# EAGLE design evpr_mini (EAGLE 9.5.2)
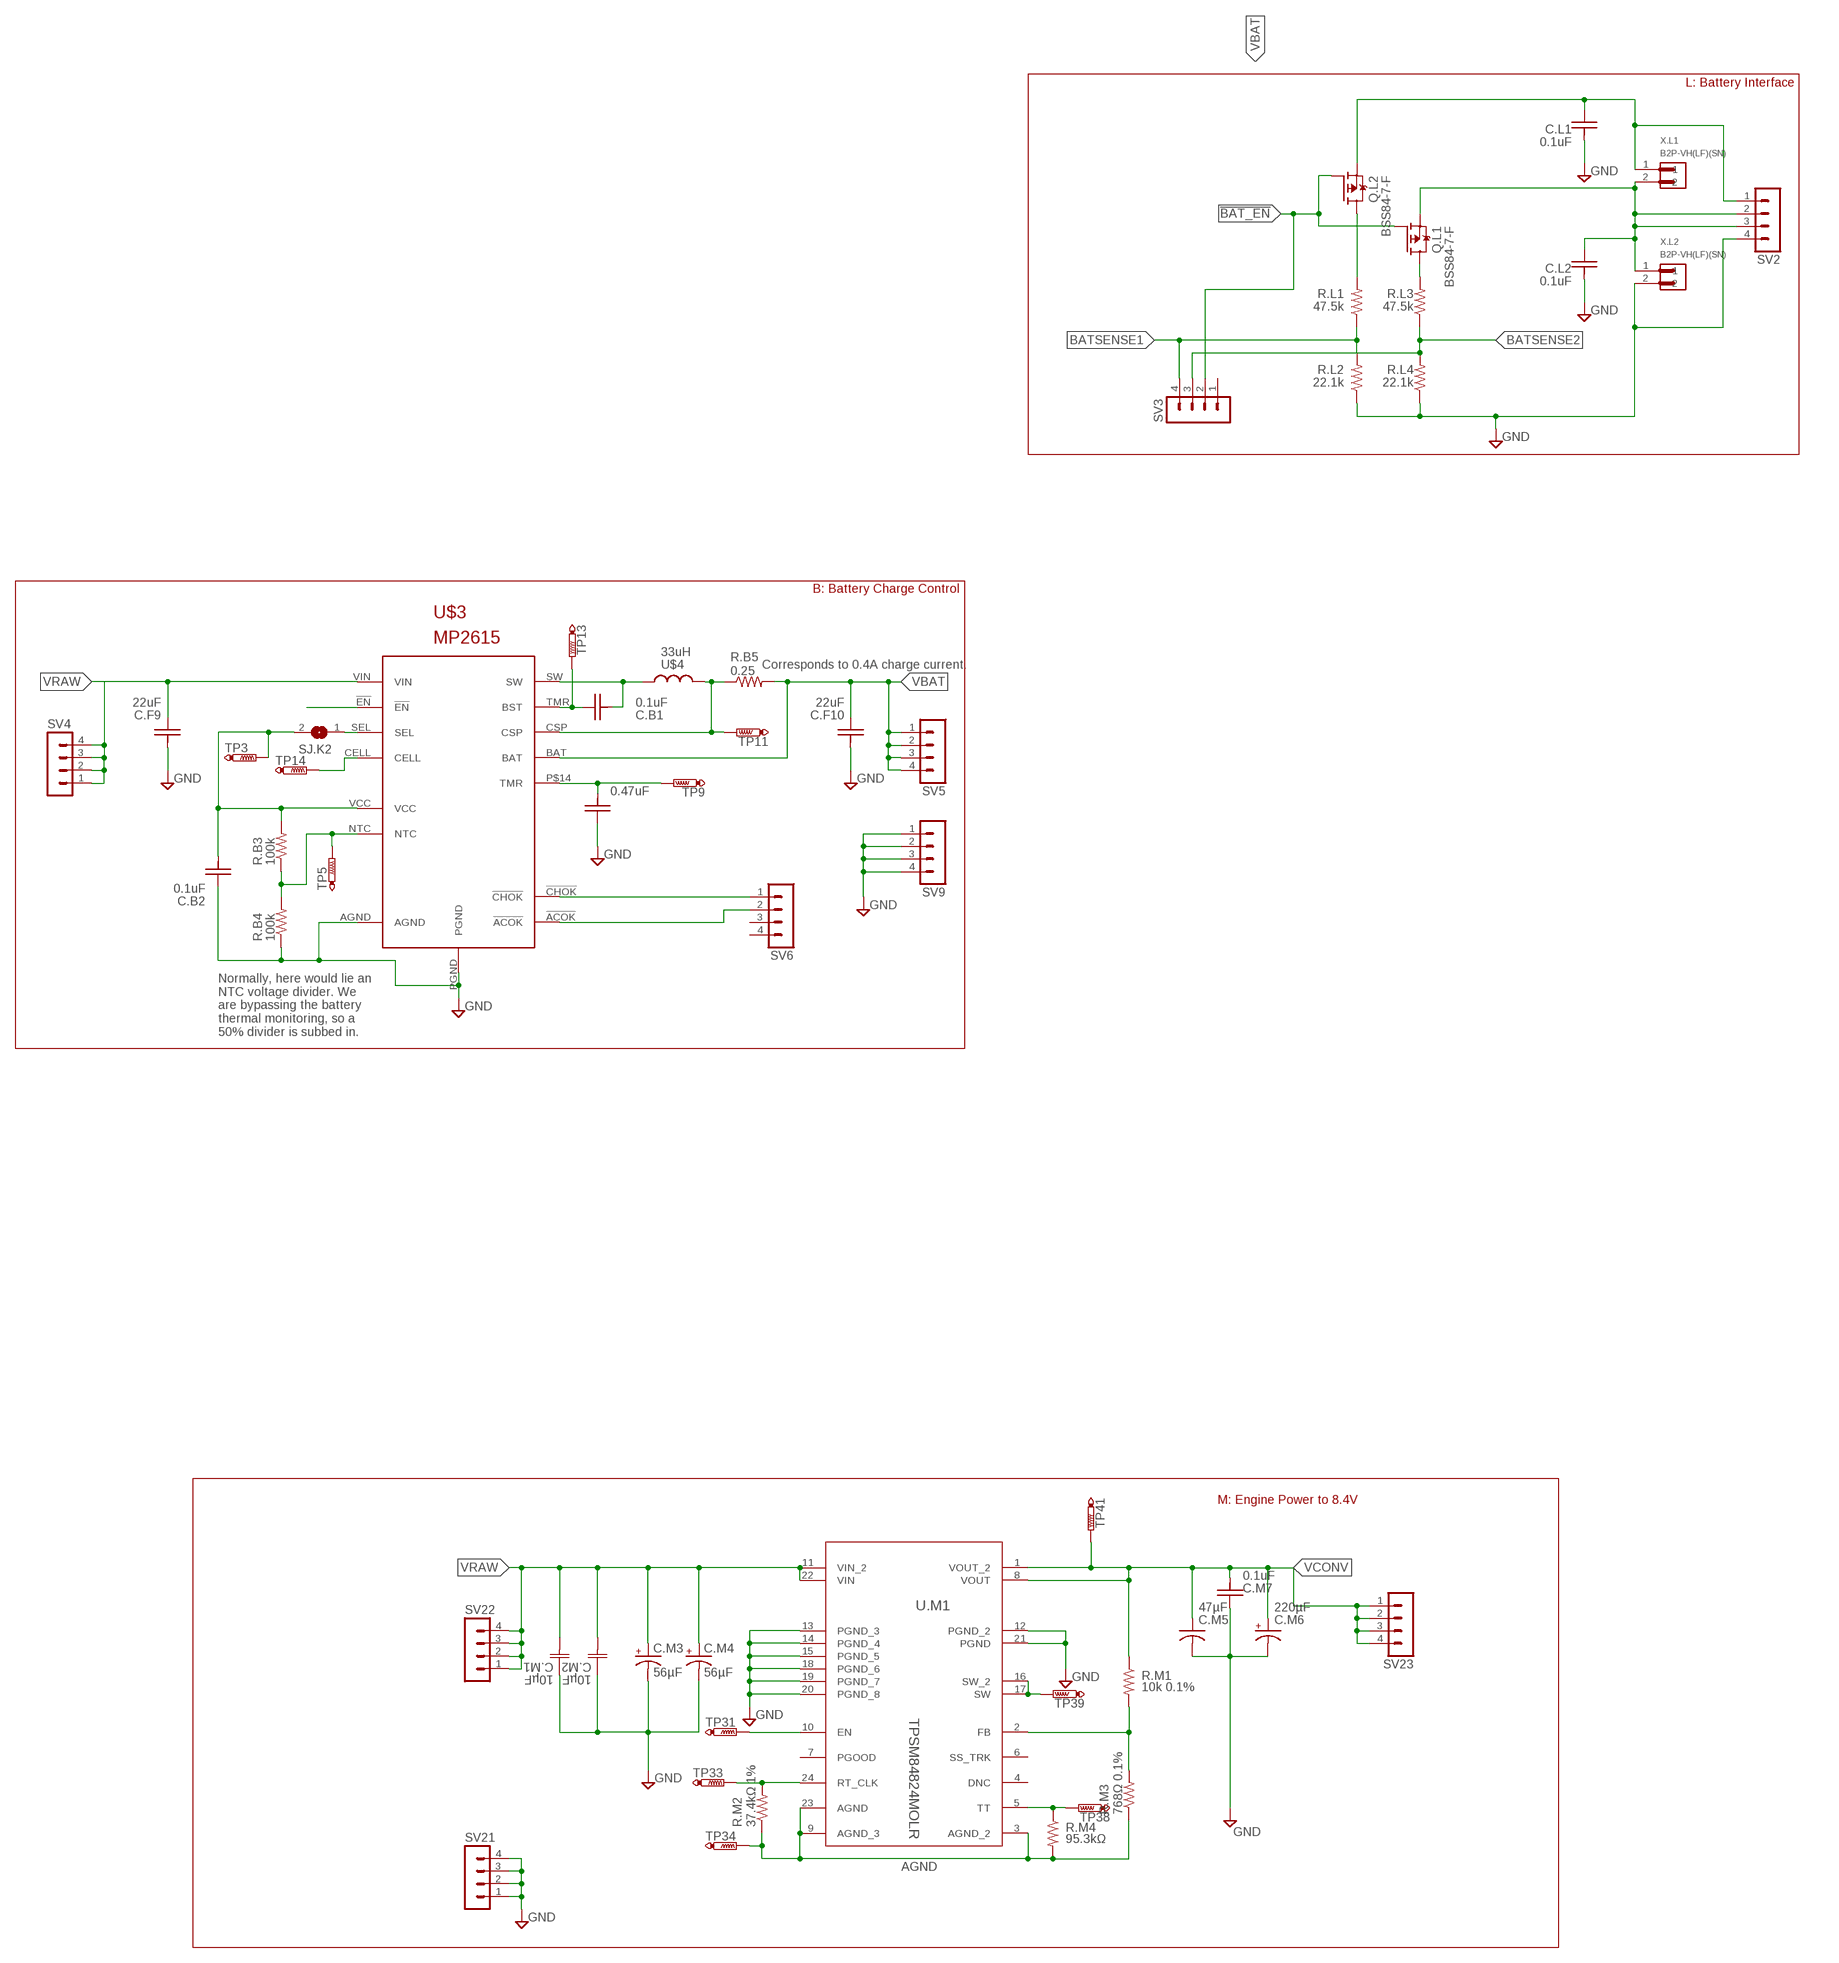
[diagram p0: schematic, sheet 1, part 1 of 2]
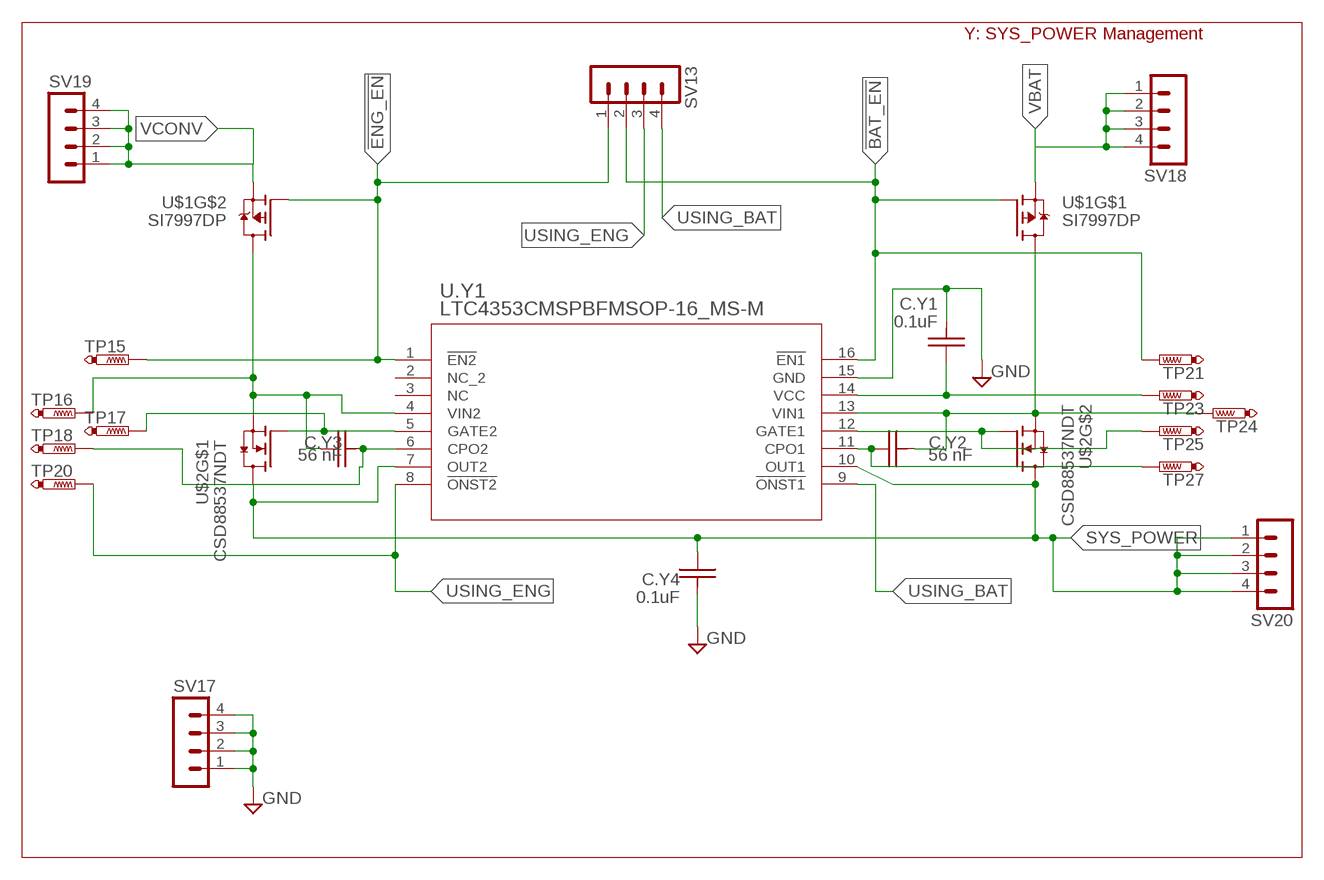
[diagram p1: schematic, sheet 1, part 2 of 2]

## Parts
C.B1  0.1uF  C0603  [C0603]
C.B2  0.1uF  C0603  [C0603]
C.F9  22uF  C0603  [C0603]
C.F10  22uF  C0603  [C0603]
C.J3  0.47uF  C0603  [C0603]
C.L1  0.1uF  C0603  [C0603]
C.L2  0.1uF  C0603  [C0603]
C.M1  10µF  C3225X7R1E106K250AC  [CAP_3225]
C.M2  10µF  C3225X7R1E106K250AC  [CAP_3225]
C.M3  56µF  6.3MMCAP  [OSCON_SVPF_6.3MM]
C.M4  56µF  6.3MMCAP  [OSCON_SVPF_6.3MM]
C.M5  47µF  C-USC1210  [C1210]
C.M6  220µF  WURTH875115352003  [C6CYLCAP]
C.M7  0.1uF  C0603  [C0603]
C.Y1  0.1uF  C0603  [C0603]
C.Y2  56 nF  C0603  [C0603]
C.Y3  56 nF  C0603  [C0603]
C.Y4  0.1uF  C0603  [C0603]
Q.L1  BSS84-7-F  [SOT23]
Q.L2  BSS84-7-F  [SOT23]
R.B3  100k  R0603  [R0603]
R.B4  100k  R0603  [R0603]
R.B5  0.25  R0603  [R0603]
R.L1  47.5k  R0603  [R0603]
R.L2  22.1k  R0603  [R0603]
R.L3  47.5k  R0603  [R0603]
R.L4  22.1k  R0603  [R0603]
R.M1  10k 0.1%  R0603  [R0603]
R.M2  37.4kΩ 1%  R0603  [R0603]
R.M3  768Ω 0.1%  R0603  [R0603]
R.M4  95.3kΩ  R0603  [R0603]
SJ.K2  SJ  [SJ]
SV2  MA04-1  [MA04-1]
SV3  MA04-1  [MA04-1]
SV4  MA04-1  [MA04-1]
SV5  MA04-1  [MA04-1]
SV6  MA04-1  [MA04-1]
SV9  MA04-1  [MA04-1]
SV13  MA04-1  [MA04-1]
SV17  MA04-1  [MA04-1]
SV18  MA04-1  [MA04-1]
SV19  MA04-1  [MA04-1]
SV20  MA04-1  [MA04-1]
SV21  MA04-1  [MA04-1]
SV22  MA04-1  [MA04-1]
SV23  MA04-1  [MA04-1]
TP3  PTR1TP10R  [TP10R]
TP5  PTR1TP10R  [TP10R]
TP9  PTR1TP10R  [TP10R]
TP11  PTR1TP10R  [TP10R]
TP13  PTR1TP10R  [TP10R]
TP14  PTR1TP10R  [TP10R]
TP15  PTR1TP10R  [TP10R]
TP16  PTR1TP10R  [TP10R]
TP17  PTR1TP10R  [TP10R]
TP18  PTR1TP10R  [TP10R]
TP20  PTR1TP10R  [TP10R]
TP21  PTR1TP10R  [TP10R]
TP23  PTR1TP10R  [TP10R]
TP24  PTR1TP10R  [TP10R]
TP25  PTR1TP10R  [TP10R]
TP27  PTR1TP10R  [TP10R]
TP31  PTR1TP10R  [TP10R]
TP33  PTR1TP10R  [TP10R]
TP34  PTR1TP10R  [TP10R]
TP38  PTR1TP10R  [TP10R]
TP39  PTR1TP10R  [TP10R]
TP41  PTR1TP10R  [TP10R]
U$1  SI7997DP  [POWERPAK_SO8DUAL]
U$2  CSD88537NDT  [SOIC8]
U$3  MP2615  [QFN16]
U$4  33uH  SRN5040TA-330M  [SRN5040TA]
U.M1  TPSM84824MOLR  [MOL0024A]
U.Y1  LTC4353CMSPBFMSOP-16_MS-M  [MSOP-16_MS-M]
X.L1  B2P-VH(LF)(SN)  [JST_B2P-VH(LF)(SN)]
X.L2  B2P-VH(LF)(SN)  [JST_B2P-VH(LF)(SN)]

## Nets
!ACOK: SV6.2 U$3.!ACOK
!BAT_EN: Q.L1.1(G) Q.L2.1(G) SV3.2 SV13.2 TP21.TP U$1.P$2(G) U.Y1.16(!EN1)
!CHGOK: SV6.1 U$3.!CHOK
!ENG_EN: SV13.1 TP15.TP U$1.P$4(G) U.Y1.1(!EN2)
AGND: R.M2.1 R.M3.1 R.M4.2 TP34.TP U.M1.3(AGND_2) U.M1.9(AGND_3) U.M1.23(AGND)
BATSENSE1: R.L1.1 R.L2.2 SV3.4
BATSENSE2: R.L3.1 R.L4.2 SV3.3
GND: C.B2.1 C.F9.2 C.F10.2 C.J3.1 C.L1.2 C.L2.2 C.M1.1 C.M2.1 C.M3.- C.M4.- C.M5.2 C.M6.P$1(-) C.M7.1 C.Y1.2 C.Y4.2 R.B4.1 R.L2.1 R.L4.1 SV2.4 SV9.1 SV9.2 SV9.3 SV9.4 SV17.1 SV17.2 SV17.3 SV17.4 SV21.1 SV21.2 SV21.3 SV21.4 U$3.AGND U$3.PGND U.M1.12(PGND_2) U.M1.13(PGND_3) U.M1.14(PGND_4) U.M1.15(PGND_5) U.M1.18(PGND_6) U.M1.19(PGND_7) U.M1.20(PGND_8) U.M1.21(PGND) U.Y1.15(GND) X.L2.2
N$1: U$3.!EN
N$2: TP14.TP U$3.CELL
N$3: R.M1.2 R.M3.2 U.M1.2(FB)
N$4: TP25.TP U$2.4(G) U.Y1.12(GATE1)
N$5: C.Y3.1 TP16.TP U$1.D$2A(D) U$2.1(S) U.Y1.4(VIN2)
N$6: C.Y2.2 TP24.TP U$1.D$1B(D) U$2.3(S) U.Y1.13(VIN1)
N$7: C.J3.2 TP9.TP U$3.P$14(TMR)
N$8: C.L2.1 Q.L1.2(S) SV2.2 SV2.3 X.L1.2 X.L2.1
N$10: TP17.TP U$2.2(G) U.Y1.5(GATE2)
N$11: TP31.TP U.M1.10(EN)
N$13: Q.L2.3(D) R.L1.2
N$15: TP39.TP U.M1.16(SW_2) U.M1.17(SW)
N$17: R.M2.2 TP33.TP U.M1.24(RT_CLK)
N$31: R.M4.1 TP38.TP U.M1.5(TT)
N$32: C.Y1.1 TP23.TP U.Y1.14(VCC)
N$33: Q.L1.3(D) R.L3.2
N$37: C.Y2.1 TP27.TP U.Y1.11(CPO1)
N$38: C.Y3.2 TP18.TP U.Y1.6(CPO2)
N$48: R.B3.1 R.B4.2 TP5.TP U$3.NTC
N$52: C.B2.2 R.B3.2 SJ.K2.2 TP3.TP U$3.VCC
N$56: R.B5.1 TP11.TP U$3.CSP U$4.P$2
N$58: SJ.K2.1 U$3.SEL
N$59: C.B1.1 TP13.TP U$3.TMR(BST)
N$60: C.B1.2 U$3.SW U$4.P$1
SYS_POWER: C.Y4.1 SV20.1 SV20.2 SV20.3 SV20.4 U$2.5(D) U$2.6(D) U$2.7(D) U$2.8(D) U.Y1.7(OUT2) U.Y1.10(OUT1)
USING_BAT: SV13.4 U.Y1.9(!ONST1)
USING_ENG: SV13.3 TP20.TP U.Y1.8(!ONST2)
VBAT: C.F10.1 C.L1.1 Q.L2.2(S) R.B5.2 SV2.1 SV5.1 SV5.2 SV5.3 SV5.4 SV18.1 SV18.2 SV18.3 SV18.4 U$1.P$1(S) U$3.BAT X.L1.1
VCONV: C.M5.1 C.M6.P$2(+) C.M7.2 R.M1.1 SV19.1 SV19.2 SV19.3 SV19.4 SV23.1 SV23.2 SV23.3 SV23.4 TP41.TP U$1.P$3(S) U.M1.1(VOUT_2) U.M1.8(VOUT)
VRAW: C.F9.1 C.M1.2 C.M2.2 C.M3.+ C.M4.+ SV4.1 SV4.2 SV4.3 SV4.4 SV22.1 SV22.2 SV22.3 SV22.4 U$3.VIN U.M1.11(VIN_2) U.M1.22(VIN)
Unconnected: SV3.1 SV6.3 SV6.4 U.M1.4(DNC) U.M1.6(SS_TRK) U.M1.7(PGOOD) U.Y1.2(NC_2) U.Y1.3(NC)

## Notes on the sheet
- L: Battery Interface
- B: Battery Charge Control
- Corresponds to 0.4A charge current.
- Normally, here would lie an
  NTC voltage divider. We
  are bypassing the battery
  thermal monitoring, so a 
  50% divider is subbed in.
- Y: SYS_POWER Management
- M: Engine Power to 8.4V

## Library data of the parts
C.B1 C.B2 C.L1 C.L2 C.M7 C.Y1 C.Y4 = mccloud:C0603: CAPACITOR, American symbol; COMPONENT: 06033C104JAT2A
C.F9 C.F10 = mccloud:C0603: CAPACITOR, American symbol; COMPONENT: CL10A226MO7JZNC
C.J3 = mccloud:C0603: CAPACITOR, American symbol; COMPONENT: C0603C474K4PACTU
C.M1 C.M2 = mccloud:C3225X7R1E106K250AC; COMPONENT: C3225X7R1E106K250AC
C.M3 C.M4 = mccloud:6.3MMCAP; COMPONENT: APXG250ARA560MF61G
C.M5 = rcl:C-US: CAPACITOR, American symbol; COMPONENT: CL32A476KOJNNNE; SPICEPREFIX: C
C.M6 = mccloud:WURTH875115352003; COMPONENT: 875075355002
C.Y2 C.Y3 = mccloud:C0603: CAPACITOR, American symbol; COMPONENT: CL10B562KB8NNNC
Q.L1 Q.L2 = mccloud:BSS84-7-F; COMPONENT: BSS84-7-F
R.B3 R.B4 = mccloud:R0603: RESISTOR, American symbol; COMPONENT: RMCF0603FT100K; SPICEPREFIX: R
R.B5 = mccloud:R0603: RESISTOR, American symbol; COMPONENT: CSR0603FKR250; SPICEPREFIX: R
R.L1 R.L3 = mccloud:R0603: RESISTOR, American symbol; COMPONENT: RMCF0603FT47K5; SPICEPREFIX: R
R.L2 R.L4 = mccloud:R0603: RESISTOR, American symbol; COMPONENT: RMCF0603FT22K1; SPICEPREFIX: R
R.M1 = mccloud:R0603: RESISTOR, American symbol; COMPONENT: RG1608P-103-B-T5; SPICEPREFIX: R
R.M2 = mccloud:R0603: RESISTOR, American symbol; COMPONENT: RC0603FR-0737K4L; SPICEPREFIX: R
R.M3 = mccloud:R0603: RESISTOR, American symbol; COMPONENT: RQ73C1J768RBTD; SPICEPREFIX: R
R.M4 = mccloud:R0603: RESISTOR, American symbol; COMPONENT: RMCF0603FT95K3; SPICEPREFIX: R
SJ.K2 = jumper:SJ: SMD solder JUMPER
SV2-SV6 SV9 SV13 SV17-SV23 = con-lstb:MA04-1: PIN HEADER; OC_FARNELL: unknown; OC_NEWARK: unknown
TP3 TP5 TP9 TP11 TP13-TP18 TP20 TP21 TP23-TP25 TP27 TP31 TP33 TP34 TP38 TP39 TP41 = testpad:PTR1: TEST PIN
U$1 = mccloud:SI7997DP; COMPONENT: SI7997DP
U$2 = mccloud:CSD88537NDT
U$3 = mccloud:MP2615
U$4 = mccloud:SRN5040TA-330M; COMPONENT: SRN5040TA-330M
U.M1 = mccloud:TPSM84824MOLR; COMPONENT: TPSM84824MOLR; MANUFACTURER_PART_NUMBER: TPSM84824MOLR; VENDOR: Texas Instruments
U.Y1 = mccloud:LTC4353CMSPBF; COMPONENT: LTC4353CMS#PBF; MANUFACTURER_PART_NUMBER: LTC4353CMS#PBF; VENDOR: Linear Technology
X.L1 X.L2 = B2P-VH_LF__SN_:B2P-VH(LF)(SN): VH Series 3.96 mm Pitch, Compact, Lock Mechanism also Prevents Misinsertion; AVAILABILITY: Unavailable; COMPONENT: B2P-VH(LF)(SN); DESCRIPTION: VH Series 3.96 mm Pitch, Compact, Lock Mechanism also Prevents Misinsertion; MF: JST Sales; MP: B2P-VH_LF__SN_; PACKAGE: FakePackage u; PRICE: None

## Board
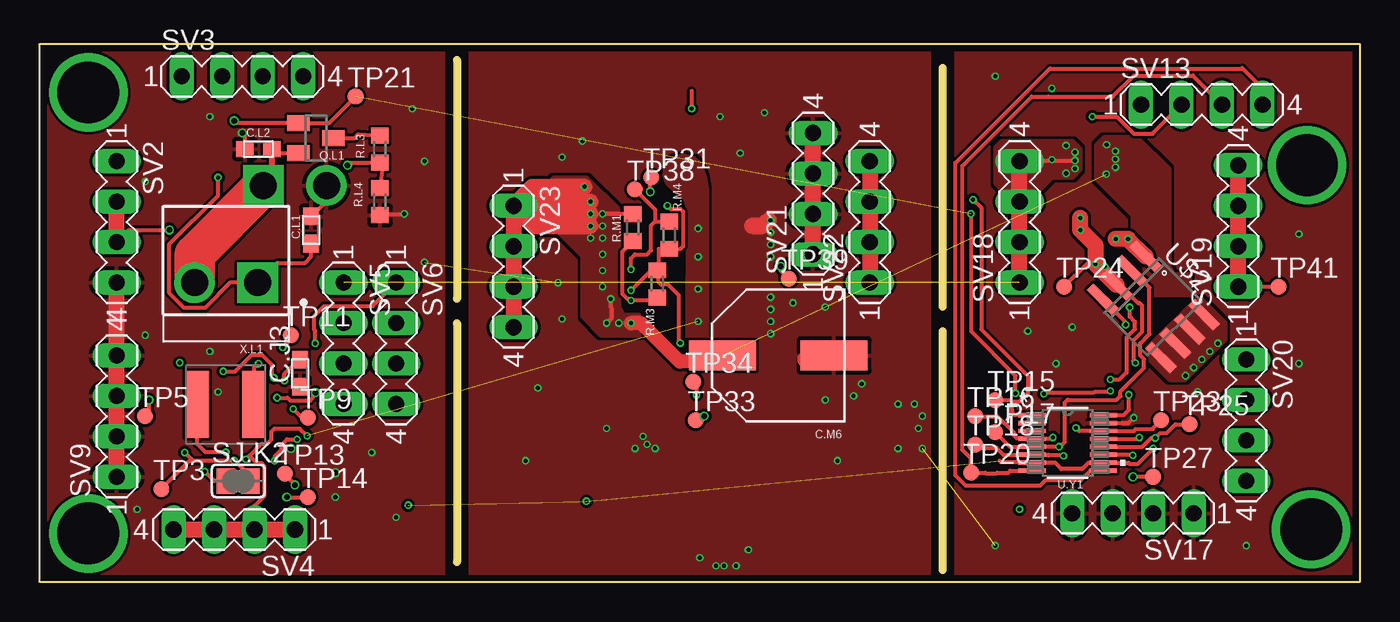
[diagram p2: board, top side]
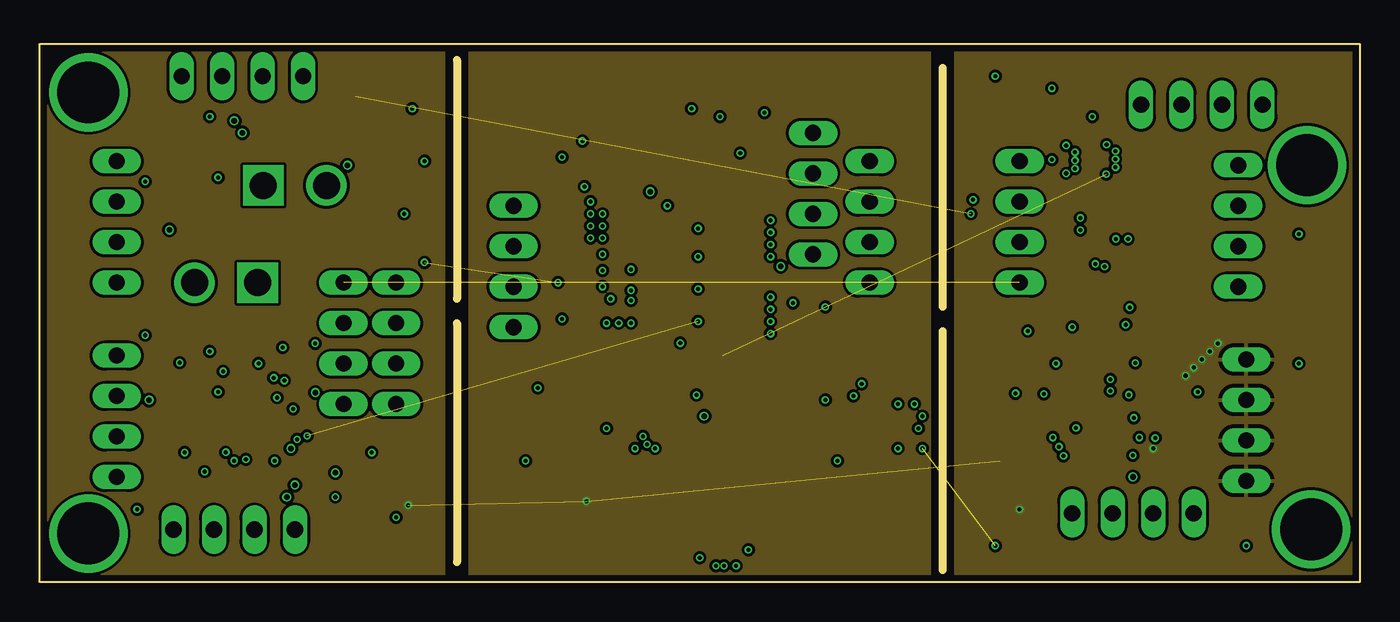
[diagram p3: board, inner layer Route2]
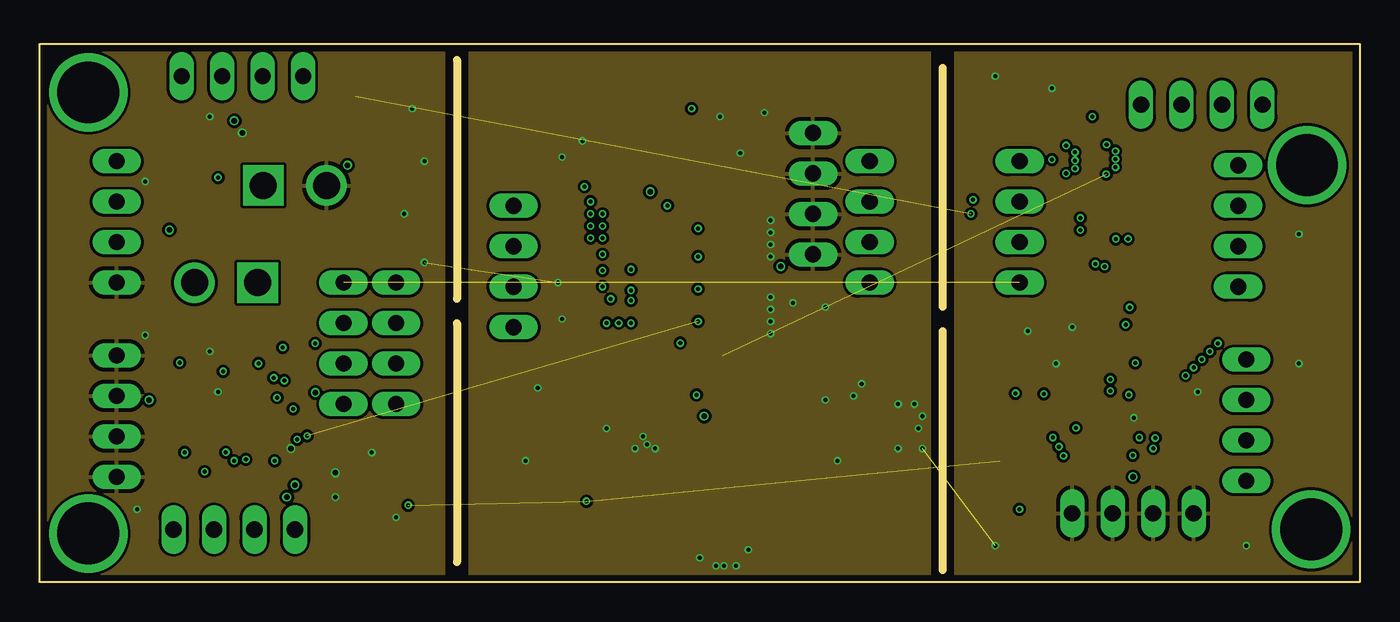
[diagram p4: board, inner layer Route15]
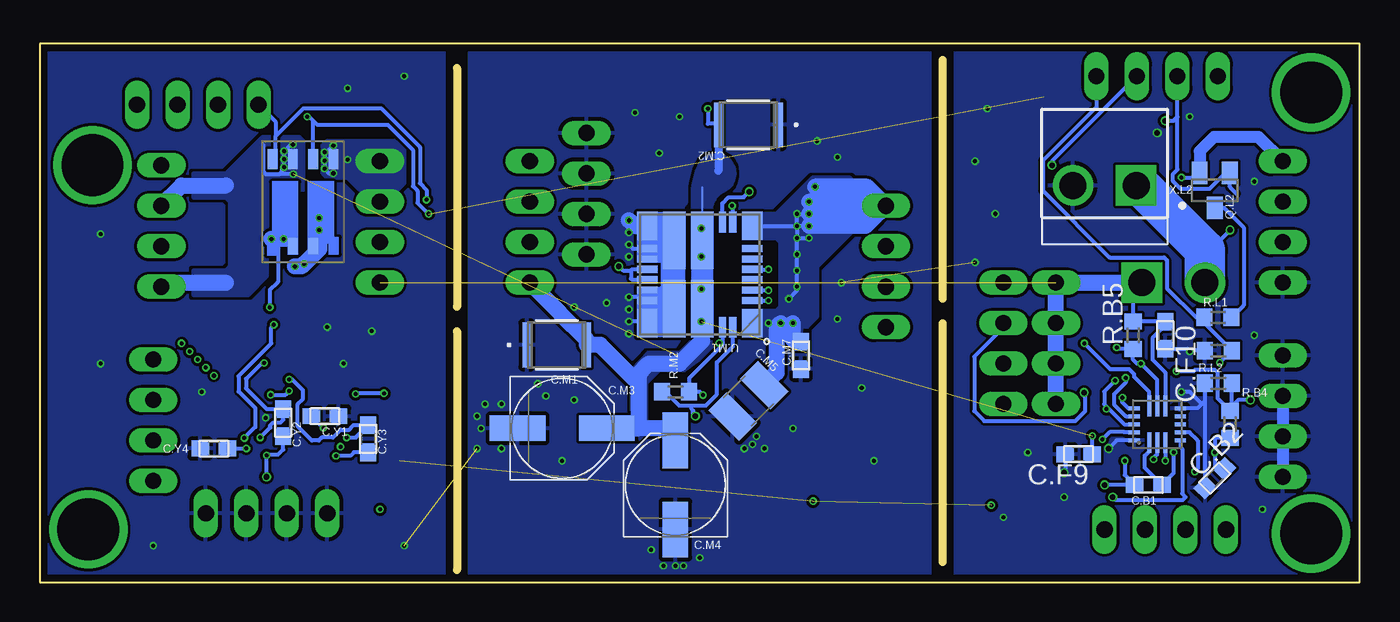
[diagram p5: board, bottom side, seen from below]

Size 82.8 x 33.78 mm. Coordinates in mm from the lower left corner, seen from the top.
Outline: 26.16,32.77 26.16,17.78
Outline: 26.16,16.26 26.16,1.27
Outline: 56.64,32.26 56.64,17.27
Outline: 56.64,15.75 56.64,0.76
Outline: 0,33.78 82.8,33.78 82.8,0 0,0 0,33.78
Copper layers (1*2*15*16): Top 0.035559375mm / dielectric 0.17018125mm / Route2 0.01778125mm / dielectric 47mil / Route15 0.01778125mm / dielectric 0.17018125mm / Bottom 0.035559375mm
Design rules "oshpark-4layer *": minimum track width 5mil, minimum drill 10mil, track to track 7mil, track to pad 7mil, pad to pad 7mil, via to via 7mil, smd to smd 5mil, copper to edge 15mil, drill to drill 6mil, minimum pad ring 4mil, minimum via ring 4mil, stop-mask expansion 2.5mil, vias tented up to drill 10mil, thermal gap 10mil
Milling: 4 lines

### Footprints (pad centres in the part's own frame; a part is rotated, then mirrored left to right if it is on the bottom)
C0603 = smd 1.1 x 1: 1 -0.85,0; 2 0.85,0
CAP_3225 = smd 0.559 x 2.794: 1 -1.88,0; 2 1.88,0
OSCON_SVPF_6.3MM = smd 3.5 x 1.6: + 2.8,0; - -2.8,0
C1210 = smd 1.6 x 2.7: 1 -1.4,0; 2 1.4,0
C6CYLCAP = smd 4.2 x 1.9: P$1 -3.5,0; P$2 3.5,0
SOT23 = smd 1 x 1.4: 1 -0.95,-1.1; 2 0.95,-1.1; 3 0,1.1
R0603 = smd 1 x 1.1: 1 -0.85,0; 2 0.85,0
SJ = smd 1.168 x 1.6: 1 -0.762,0; 2 0.762,0
MA04-1 = drill 1.016 long: 1 -3.81,0; 2 -1.27,0; 3 1.27,0; 4 3.81,0
TP10R = smd 1 x 1: TP 0,0
POWERPAK_SO8DUAL = smd 1.02 x 0.61: D$1B 2.795,0.635; D$2A 2.795,-0.635 | smd 1.27 x 0.61: P$1 -2.67,1.905; P$2 -2.67,0.635; P$3 -2.67,-0.635; P$4 -2.67,-1.905
SOIC8 = smd 0.6 x 2.2: 1 -1.905,-2.6; 2 -0.635,-2.6; 3 0.635,-2.6; 4 1.905,-2.6; 5 1.905,2.6; 6 0.635,2.6; 7 -0.635,2.6; 8 -1.905,2.6
QFN16 = smd 0.25 x 0.7: !ACOK 1,1.45; !EN 0,-1.45; AGND 1,-1.45; CELL -1,-1.45; NC 0.5,-1.45; NTC 0.5,1.45; P$14 0,1.45; PGND -1,1.45; SEL -0.5,-1.45; TMR -0.5,1.45 | smd 1.3 x 0.25: !CHOK 1.15,0.5; BAT 1.15,-0.5; CSP 1.15,0; SW -1.15,0.5; VCC -1.15,-0.5; VIN -1.15,0
SRN5040TA = smd 1.5 x 4.2: P$1 -1.8,0; P$2 1.8,0
MOL0024A = smd 1.3 x 1.8: 1 -3.3,3.05; 8 -3.3,-3.05; 13 3.3,-3.05; 20 3.3,3.05 | smd 1.3 x 0.45: 2 -3.3,1.625; 3 -3.3,0.975; 4 -3.3,0.325; 5 -3.3,-0.325; 6 -3.3,-0.975; 7 -3.3,-1.625; 14 3.3,-1.625; 15 3.3,-0.975; 16 3.3,-0.325; 17 3.3,0.325; 18 3.3,0.975; 19 3.3,1.625 | smd 0.45 x 1.3: 9 -2.075,-3.3; 10 -1.425,-3.3; 23 -1.425,3.3; 24 -2.075,3.3 | smd 1.4 x 3.6: 11 -0.15,-2.15; 12 1.6,-2.15; 21 1.6,2.15; 22 -0.15,2.15
MSOP-16_MS-M = smd 1.702 x 0.279: 1 -2.235,1.751; 2 -2.235,1.251; 3 -2.235,0.751; 4 -2.235,0.25; 5 -2.235,-0.25; 6 -2.235,-0.751; 7 -2.235,-1.251; 8 -2.235,-1.751; 9 2.235,-1.751; 10 2.235,-1.251; 11 2.235,-0.751; 12 2.235,-0.25; 13 2.235,0.25; 14 2.235,0.751; 15 2.235,1.251; 16 2.235,1.751
JST_B2P-VH(LF)(SN) = drill 1.7 square: 1 -1.98,0 | drill 1.7: 2 1.98,0

### Placement (x,y rotation side)
C.B1  13.26,6.1 0 bottom
C.B2  9.09,6.53 45 bottom
C.F9  17.63,8.03 180 bottom
C.F10  12.19,15.49 270 bottom
C.J3  16.33,13.11 90 top
C.L1  17.02,22.1 90 top
C.L2  13.72,27.18 180 top
C.M1  50.37,14.88 0 bottom
C.M2  38.35,28.7 180 bottom
C.M3  50.04,9.65 0 bottom
C.M4  42.93,6.1 90 bottom
C.M5  38.35,11.38 225 bottom
C.M6  46.33,14.22 180 top
C.M7  35.05,14.22 90 bottom
C.Y1  64.92,10.41 0 bottom
C.Y2  67.54,10.01 90 bottom
C.Y3  62.2,8.99 270 bottom
C.Y4  71.88,8.38 180 bottom
Q.L1  17.32,27.86 270 top
Q.L2  9.09,24.59 180 bottom
R.B3  8.13,9.91 270 bottom
R.B4  8.86,12.47 0 bottom
R.B5  14.22,15.49 90 bottom
R.L1  8.89,16.61 0 bottom
R.L2  8.86,14.53 0 bottom
R.L3  21.34,27.18 90 top
R.L4  21.34,23.88 90 top
R.M1  37.21,22.25 270 top
R.M2  42.93,11.94 180 bottom
R.M3  38.73,18.72 270 top
R.M4  39.5,21.77 270 top
SJ.K2  12.45,6.35 0 top
SV2  4.83,22.61 270 top
SV3  12.7,31.75 0 top
SV4  12.19,3.3 180 top
SV5  19.05,14.99 270 top
SV6  22.35,14.99 270 top
SV9  4.83,10.41 90 top
SV13  72.9,29.97 0 top
SV17  68.58,4.32 180 top
SV18  61.47,22.61 90 top
SV19  75.18,22.35 90 top
SV20  75.69,10.16 270 top
SV21  48.51,24.38 90 top
SV22  52.07,22.61 90 top
SV23  29.72,19.81 270 top
TP3  7.62,5.84 0 top
TP5  6.6,10.41 0 top
TP9  16.81,10.31 0 top
TP11  15.75,15.49 0 top
TP13  15.37,6.81 0 top
TP14  16.81,5.33 0 top
TP15  59.94,11.43 0 top
TP16  58.67,10.41 0 top
TP17  59.94,9.4 0 top
TP18  58.67,8.64 0 top
TP20  58.42,6.86 0 top
TP21  19.81,30.48 0 top
TP23  70.36,10.16 0 top
TP24  64.26,18.54 0 top
TP25  72.14,9.91 0 top
TP27  69.85,6.6 0 top
TP31  38.35,25.4 0 top
TP33  41.15,10.16 0 top
TP34  41,12.57 0 top
TP38  37.34,24.64 0 top
TP39  46.99,19.05 0 top
TP41  77.72,18.54 0 top
U$1  66.29,23.88 270 bottom
U$2  69.85,17.27 225 top
U$3  12.7,9.91 90 bottom
U$4  11.66,11.15 0 top
U.M1  41.4,19.3 180 bottom
U.Y1  64.49,8.74 0 top
X.L1  11.68,18.8 180 top
X.L2  16,24.89 180 bottom

### Tracks (layer width: path | path; a pad name or v marks a point on that pad's centre or on a via)
!ACOK  (via drill 0.25, 0.35)
  Top 0.254: v14.88,11.57 15.53,11.57 15.71,11.4 16.96,11.4 17.14,11.58 17.14,11.74 v17.29,11.9
  Bottom 0.254: U$3.!ACOK 14.51,10.91 14.88,11.27 v14.88,11.57 | v17.29,11.9 17.29,11.68 17.22,11.62 17.22,10.73 17.85,10.11 23.56,10.11 24.18,10.73 24.18,14.16 22.35,15.99 SV6.2
!BAT_EN  (via drill 0.25, 0.35)  (1 unrouted)
  Top 0.254: v61.21,11.85 61.21,12.95 58.42,15.75 v58.42,23.11 | v62.99,11.81 63.09,11.91 66.16,11.91 66.18,11.92 67.08,11.92 v67.16,12 | U.Y1.16 68,10.49 68.33,10.82 v68.33,11.76 | TP21.TP 18.15,28.81 Q.L1.1 12.33,28.81 v12.19,28.96 | v66.04,29.21 67.58,29.21 68.65,28.14 69.8,28.14 SV13.2
  Bottom 0.254: U$1.P$2 65.66,28.96 | v66.04,29.21 65.91,29.21 65.66,28.96 | 65.66,28.96 65.41,28.7 60.97,28.7 59.39,27.12 59.39,24.85 59.11,24.56 59.11,23.8 v58.42,23.11 | 7.73,24.38 8.14,24.79 Q.L2.1 8.41,25.69 9.42,24.68 11.21,24.68 11.71,25.18 11.71,25.62 11.43,25.9 11.43,29.21 | v61.21,11.85 62.95,11.85 v62.99,11.81 | v68.33,11.76 67.4,11.76 v67.16,12 | 11.43,29.21 SV3.2 | v12.19,28.96 11.68,28.96 11.43,29.21
!CHGOK  (via drill 0.25)
  Top 0.254: SV6.1 20.88,17.32 17.85,17.32 17.22,16.7 17.22,15.81 17.27,15.76 v17.27,14.99
  Bottom 0.254: U$3.!CHOK 13.2,11.93 14.15,12.88 14.15,13.05 14.46,13.36 15.65,13.36 v17.27,14.99
!ENG_EN  (via drill 0.25)
  Top 0.254: v58.55,24 59.06,23.49 59.06,15.86 61.98,12.95 61.98,11.86 61.44,11.32 61.1,11.32 61.09,11.3 | 61.09,11.3 60.96,11.18 60.96,10.9 60.97,10.88 60.97,10.67 61.15,10.49 U.Y1.1 62.92,10.49 | TP15.TP 60.88,11.43 60.99,11.32 61.07,11.32 61.09,11.3
  Bottom 0.254: v58.55,24 58.55,24.61 58.96,25.03 58.96,27.3 61.41,29.74 66.26,29.74 68.02,27.98 | U$1.P$4 68.02,26.72 68.02,27.98 | SV13.1 68.02,28.91 68.02,27.98
AGND  (via drill 0.25)
  Top 0.254: v37.08,18.31 38.34,19.57 R.M3.1 38.83,19.66 | v39.37,23.62 39.57,23.42 40.18,23.42 40.35,23.25 40.35,21.08 40.19,20.92 R.M4.2 38.83,20.92 38.83,19.66 | v40.18,15 40.1,15.08 40.1,17.99 39.41,18.67 38.98,18.67 38.83,18.83 38.83,19.66 | TP34.TP 41.2,12.37 v41.2,11.73
  Bottom 0.254: U.M1.3 37.08,18.33 v37.08,18.31 | U.M1.23 39.98,14.89 | U.M1.9 39.33,23.58 v39.37,23.62 | 39.98,14.89 42.08,12.79 R.M2.1 41.4,11.94 v41.2,11.73 | 39.98,14.89 40.09,15 v40.18,15
BATSENSE1  (via drill 0.25)
  Bottom 0.254: v8.78,13.77 v8.77,13.77 R.L2.2 9.74,16.25 R.L1.1 10.26,16.61 12.08,18.43 12.08,20.2 12.26,20.38 15.7,20.38 19.88,24.56 19.88,26.45 16.51,29.82 SV3.4
BATSENSE2  (via drill 0.35)
  Top 0.254: R.L4.2 21.5,26.16 R.L3.1 19.47,26.33 v19.3,26.16
  Bottom 0.254: SV3.3 19.3,26.42 v19.3,26.16
GND  (via drill 0.25, 0.35)  (2 unrouted)
  Top 0.254: U.Y1.15 68.31,9.99 v68.63,10.31 | R.L4.1 21.42,23.11 v22.86,23.11 | C.L1.2 17.98,23.91 X.L2.2 | C.L2.2 12.87,28.03 v12.7,28.19 | v45.85,22.71 45.72,22.71 44.7,22.71 U.M1.13
  Top 1.016: SV9.1 SV9.2 SV9.3 SV9.4 SV2.4 | SV21.1 SV21.2 SV21.3 SV21.4 | U.M1.13 45.36,22.35 45.72,22.71 | C.M6.P$1 49.58,13.97 48.01,13.97
  Bottom 0.254: U$3.AGND 10.18,10.91 9.91,11.18 | 9.91,11.18 9.71,11.37 R.B4.1 9.71,5.95 C.B2.1 | 9.91,11.18 10.67,11.94 v11.18,11.94 | R.L2.1 10.62,14.53 v10.67,14.48 10.83,14.64 C.F10.2 | U$3.PGND 15.24,8.91 15.75,8.4 v15.75,8.38 | C.F9.2 18.48,6.92 v18.54,6.86 | U.M1.19 U.M1.18 | U.M1.19 44.91,17.88 v45.85,17.88 | U.M1.19 44.18,17.15 U.M1.21 | U.M1.20 44.81,16.36 v45.85,16.36 | U.M1.15 U.M1.14 45.59,20.93 v45.85,21.18
  Bottom 0.762: SV9.3 SV9.1
  Bottom 1.016: v45.85,22.71 45.49,22.35 U.M1.13
  other vias: 45.85,15.6 45.85,17.12 45.85,20.42 45.85,21.95 42.42,1.02 42.93,1.02 43.69,1.02 44.45,2.03 41.4,1.52 53.85,8.38 55.37,8.38 55.12,9.65 55.37,10.41 53.85,11.18 54.86,11.18 51.56,12.45 51.05,11.68 50.04,7.62 37.85,9.14 38.1,8.64 38.61,8.38 37.34,8.38 22.35,4.06 20.83,8.13 18.54,5.33 6.1,4.57 6.6,15.49 10.67,29.21 6.6,25.15 23.37,29.72 24.13,26.42 24.13,20.07 32.77,26.67 34.04,27.69 42.67,29.21 43.94,26.92 45.47,29.46 47.24,17.53 49.28,17.27 49.28,11.43 35.56,9.65 32.77,16.51 32.51,18.8 31.24,12.19 30.48,7.62 59.94,31.75 63.5,30.99 61.98,15.75 64.77,16 63.75,13.72 78.99,21.84 78.99,13.72 59.94,2.29 75.69,2.29 72.64,11.94
  cutout Bottom (rank 3): 45.29,23.22 45.31,23.11 45.31,19.96 43.94,19.96 43.94,18.59 45.31,18.62 45.31,15.42 42.37,15.42 42.82,14.68 42.11,15.29 42.04,24.03 42.11,24.03 arc48 42.27,23.55 arc-75 42.32,23.24 42.32,23.11
  pour Route15 (rank 4): 0.51,33.27 0.51,0.51 25.4,0.51 25.4,33.27
  pour Route15 (rank 4): 26.92,33.27 26.92,0.51 55.88,0.51 55.88,33.27
  pour Route15 (rank 4): 57.4,33.27 57.4,0.51 82.3,0.51 82.3,33.27
  pour Bottom (rank 4): 0.51,33.27 0.51,0.51 25.4,0.51 25.4,33.27
  pour Bottom (rank 4): 26.92,33.27 26.92,0.51 55.88,0.51 55.88,33.27
  pour Bottom (rank 4): 57.4,33.27 57.4,0.51 82.3,0.51 82.3,33.27
  pour Top (rank 4): 57.4,33.27 57.4,0.51 82.3,0.51 82.3,33.27
  pour Top (rank 4): 26.92,33.27 26.92,0.51 55.88,0.51 55.88,33.27
  pour Top (rank 4): 0.51,33.27 0.51,0.51 25.4,0.51 25.4,33.27
N$2  (via drill 0.35)
  Top 0.254: v15.49,5.33 TP14.TP
  Bottom 0.254: U$3.CELL 11.25,8.49 11.13,8.37 11.13,5.55 10.92,5.33 11.12,5.13 15.29,5.13 v15.49,5.33
N$3  (via drill 0.25)
  Top 0.254: R.M3.2 38.54,17.68 v37.08,17.68 36.98,17.78 36.86,17.78 36.55,18.09 36.55,20.74 R.M1.2
  Bottom 0.254: U.M1.2 v37.08,17.68
N$4  (via drill 0.25)
  Top 0.254: U.Y1.12 69.16,8.49 69.72,9.04 v69.98,9.04 70.29,9.35 70.69,9.35 71.24,9.91 TP25.TP | v68.12,16.15 68.12,16.3 U$2.4 | U$2.4
  Bottom 0.254: v68.12,16.15 68.28,15.99 68.28,14.98 70.33,12.93 70.33,11.96 69.29,10.92 69.29,9.73 v69.98,9.04
N$5  (via drill 0.25)
  Top 0.254: U.Y1.4 62.48,8.99 | v63.55,9.07 63.47,8.99 62.48,8.99 | v67.16,12.73 67.74,12.73 68.17,13.16 68.17,15.35 68.71,15.88 68.71,16.33 68.37,16.67 v68.37,17.24 | 62.48,8.99 62.43,9.04 61.28,9.04 61.1,9.22 61.1,9.38 60.07,10.41 TP16.TP | U$2.1
  Top 1.016: U$2.1 v68.28,21.54 67.49,21.54
  Bottom 0.254: v63.55,9.07 62.98,9.07 C.Y3.1 63.14,9.84 63.41,9.57 63.92,9.57 64.41,9.08 65.12,9.08 65.3,8.89 65.74,8.89 66.63,9.78 66.63,11.18 66.29,11.51 66.29,12.04 66.98,12.73 v67.16,12.73 | v68.28,21.54 67.86,21.13 67.86,18.84 68.37,18.33 v68.37,17.24 | U$1.D$2A 67.05,21.08 v67.51,21.54 67.28,21.54
  Bottom 1.016: 67.28,21.54 v68.28,21.54
N$6  (via drill 0.25)
  Top 0.254: v68.98,9.07 68.88,8.97 66.75,8.97 U.Y1.13 | v68.73,13.76 68.6,13.89 68.6,15.17 69.16,15.73 69.16,17.34 68.98,17.53 68.89,17.53 67.76,18.66 U$2.3 | 67.82,18.66 U$2.3 | U$2.3 67.56,19.05 v66.8,19.81 | TP24.TP 65.69,19.97 v66.23,19.97 | U$2.3 67.54,18.66 | U$2.3
  Top 1.016: U$2.3 67.54,18.66 v66.23,19.97 66.23,21.15 v65.28,22.1 v65.28,22.86
  Bottom 0.254: v68.98,9.07 68.34,9.7 68.34,9.83 68.16,10.01 67.71,10.01 67.54,10.19 C.Y2.2 68.56,10.86 69.88,12.17 69.88,12.75 68.87,13.76 v68.73,13.76 | v65.28,22.1 U$1.D$1B | v66.23,19.97 v66.22,19.97
  Bottom 1.016: 65.28,22.54 65.28,20.91 v66.22,19.97 | v66.23,19.97 66.39,19.81 v66.8,19.81
N$7  (via drill 0.25)
  Top 0.254: v15.34,12.65 15.34,13.06 16.24,13.96 C.J3.2 | TP9.TP 16.45,10.31 v15.89,10.87
  Bottom 0.254: v15.34,12.65 16.03,11.96 16.03,11.16 15.89,11.03 | U$3.P$14 14.77,9.91 15.89,11.03 | v15.89,10.87 15.89,11.03
N$8  (via drill 0.35)
  Top 0.254: C.L2.1 14.83,26.91 Q.L1.2 | SV2.3 5.59,22.1 v8.13,22.1
  Top 0.381: X.L2.1 14.57,25.44 C.L2.1
  Top 1.016: SV2.3 SV2.2
  Top 2.54: X.L2.1 9.7,20.57 X.L1.2
  Bottom 0.254: v8.13,22.1 9.7,20.52 X.L1.2
  Bottom 2.54: X.L1.2 9.7,20.83 13.77,24.89 X.L2.1
N$9  (via drill 3.89)
  other vias: 79.5,26.16
N$10  (via drill 0.25)
  Top 0.254: TP17.TP 60.85,8.49 U.Y1.5 v63.94,8.49 v63.94,8.5 64,8.5 64.3,8.8 64.3,11.26 64.48,11.44 67.55,11.44 67.79,11.68 67.79,11.98 69.27,13.45 69.27,14 69.04,14.23 69.04,14.99 69.62,15.57 69.62,18.48 68.54,19.56 U$2.2
N$11  (via drill 0.35)
  Top 0.254: v38.29,24.51 38.29,25.34 TP31.TP
  Bottom 0.254: v38.29,24.51 38.64,24.16 39.59,24.16 39.98,23.77 U.M1.10
N$12  (via drill 3.89)
  other vias: 79.76,3.3
N$13
  Bottom 0.254: R.L1.2 7.28,17.37 7.28,22.26 8.5,23.49 Q.L2.3
N$14  (via drill 3.89)
  other vias: 3.05,3.05
N$15  (via drill 0.35)
  Top 0.254: TP39.TP 46.48,19.56 v46.48,19.81
  Bottom 0.254: U.M1.16 45.65,19.63 45.72,19.56 | 45.72,19.56 45.72,19.05 45.65,18.98 U.M1.17 | v46.48,19.81 46.23,19.56 45.72,19.56
N$16  (via drill 3.89)
  other vias: 3.05,30.73
N$17  (via drill 0.35)
  Top 0.254: TP33.TP 41.4,10.41 v41.67,10.41
  Bottom 0.254: 41.91,11.08 42.7,11.08 43.56,11.94 R.M2.2 | 41.91,11.08 41.02,11.08 40.32,11.78 40.32,13.79 39.44,14.68 39.42,14.68 39.33,14.77 U.M1.24 | v41.67,10.41 41.82,10.56 41.82,10.77 41.91,10.86 41.91,11.08
N$31  (via drill 0.25)
  Top 0.254: v37.08,19.63 37.08,20.32 37.34,20.57 38.1,20.57 38.35,20.83 38.35,22.36 38.61,22.62 | 38.61,22.62 R.M4.1 | TP38.TP 38.61,23.37 38.61,22.62
  Bottom 0.254: U.M1.5 v37.08,19.63
N$32  (via drill 0.25)
  Top 0.254: v65.01,9.68 65.2,9.49 U.Y1.14 68.64,9.49 68.76,9.6 69.8,9.6 TP23.TP
  Bottom 0.254: v65.01,9.68 65.04,9.68 C.Y1.1
N$33
  Top 0.254: Q.L1.3 19.74,27.86 19.98,28.11 R.L3.2
N$37  (via drill 0.25, 0.35)
  Top 0.254: v68.58,7.95 68.55,7.99 U.Y1.11 | TP27.TP v68.58,6.6
  Bottom 0.254: C.Y2.1 67.54,8.32 67.85,8.01 68.53,8.01 v68.58,7.95 v68.58,6.6
N$38  (via drill 0.25)
  Top 0.254: v64.22,7.92 64.21,7.94 63.29,7.94 63.24,7.99 U.Y1.6 60.46,7.99 60.02,8.42 58.88,8.42 TP18.TP
  Bottom 0.254: C.Y3.2 63.09,8.14 63.31,7.92 v64.22,7.92
N$48  (via drill 0.25, 0.35)
  Top 0.254: v11.51,13.23 12.26,13.23 13.28,14.25 13.94,14.25 14.54,13.65 14.54,12.97 v14.68,12.83 | TP5.TP 6.86,10.67 v6.86,11.43
  Bottom 0.254: R.B4.2 8.02,10.87 R.B3.1 8.21,10.84 | 8.21,10.84 8.91,11.54 8.91,13.15 9.09,13.33 10.34,13.33 10.43,13.23 v11.51,13.23 | v14.68,12.83 14.68,12.52 15.42,11.79 15.42,11.17 14.66,10.41 U$3.NTC | v6.86,11.43 7.62,11.43 8.21,10.84
N$52  (via drill 0.25)
  Top 0.254: SJ.K2.2 13.21,6.66 12.24,7.62 v12.19,7.62 12.17,7.59 9.62,7.59 | 9.62,7.59 v9.08,8.13 | TP3.TP 9.37,7.59 9.62,7.59
  Bottom 0.254: U$3.VCC v12.2,7.63 v12.19,7.62 | C.B2.2 8.38,7.24 9.03,7.24 9.08,7.29 v9.08,8.13 v9.09,8.14 9.09,9.06 R.B3.2
N$56  (via drill 0.25)
  Top 0.254: U$4.P$2 13.46,13.46 v13.72,13.72 | v15.24,14.73 15.75,15.24 TP11.TP
  Bottom 0.254: U$3.CSP 12.7,12.7 v13.72,13.72 13.97,13.72 14.22,13.97 R.B5.1 15.15,14.64 v15.24,14.73
N$58  (via drill 0.25)
  Top 0.254: SJ.K2.1 10.92,6.35 v10.34,6.93
  Bottom 0.254: v10.34,6.93 10.16,7.11 10.16,8.89 10.68,9.41 U$3.SEL
N$59  (via drill 0.25, 0.35)
  Top 0.254: v14.73,7.62 14.76,7.92 15.17,8.33 15.17,8.62 15.51,8.96 15.99,8.96 v16.15,8.96 | v16,6.1 15.37,6.73 TP13.TP
  Bottom 0.254: U$3.TMR 14.75,9.41 14.76,9.42 15.68,9.42 v16.15,8.96 | v14.73,7.62 14.73,6.72 C.B1.1 v16,6.1
N$60  (via drill 0.25)
  Top 0.254: v11.67,8.15 10.39,8.15 9.86,8.68 U$4.P$1
  Bottom 0.254: U$3.SW 13.21,8.2 13.49,7.92 13.49,7.17 C.B1.2 11.66,6.85 11.66,7.84 11.67,7.85 v11.67,8.15
SYS_POWER  (via drill 0.25)  (2 unrouted)
  Top 0.254: v69.85,8.38 68.89,7.42 68.36,7.42 68.29,7.49 U.Y1.10 65.79,7.49 65.41,7.11 64.09,7.11 63.7,7.49 U.Y1.7 62.2,7.54 60.3,7.54 60.22,7.62
  Bottom 0.254: C.Y4.1 v69.85,8.38
  other vias: 73.91,14.99 73.41,14.48 72.9,13.97 72.39,13.46 71.88,12.95 23.11,4.83 34.29,5.08 61.47,4.57
  pour Top (no thermals): 72.57,17.78 69.34,14.55 69.34,14.22 70.87,12.7 71.88,12.7 74.42,15.24 74.42,16.26 72.9,17.78
  pour Route2 (rank 4): 0.51,33.27 0.51,0.51 25.4,0.51 25.4,33.27
  pour Route2 (rank 4): 26.92,33.27 26.92,0.51 55.88,0.51 55.88,33.27
  pour Route2 (rank 4): 57.4,33.27 57.4,0.51 82.3,0.51 82.3,33.27
USING_BAT
  Top 0.254: U.Y1.9 65.9,6.99 65.29,6.38 63.07,6.38 62.74,6.05 58.09,6.05 57.44,6.7 57.44,26.3 63.37,32.23 75.41,32.23 75.44,32.26 76.71,30.99 SV13.4
USING_ENG
  Top 0.254: U.Y1.8 60.88,6.99 60.76,6.86 60.07,6.86 60.02,6.81 59.36,6.81 59.31,6.86 TP20.TP 58.42,7.75 57.87,8.3 57.87,26.12 62.23,30.48 63.25,30.48 63.28,30.45 67.3,30.45 68.65,31.8 72.34,31.8 SV13.3
VBAT  (via drill 0.25)  (1 unrouted)
  Top 0.254: v11.18,25.4 11.18,24.27 8.12,21.22 8.12,18.14 9.05,17.22 10.36,17.22 11.94,18.8 X.L1.1 | X.L1.1 13.97,19.1 | 61.72,26.47 v64.95,26.47 | C.L1.1 17.02,20.42 16.64,20.04 14.91,20.04 X.L1.1
  Top 1.016: SV18.1 SV18.2 SV18.3 SV18.4
  Bottom 0.254: v11.18,25.4 10.33,25.4 Q.L2.2 | U$1.P$1 64.87,26.55 v64.95,26.47 | v64.95,26.47 v64.95,26.98 64.82,26.98 v64.39,27.41 | v64.95,26.47 v64.95,25.96 64.64,25.65 v64.39,25.65 | X.L1.1 14.22,18.24 R.B5.2 C.F10.1 12.19,16.12 13,15.32 13,13.97 12.2,13.17 U$3.BAT
  Bottom 0.762: SV2.1 6.35,27.94 9.14,27.94 10.04,27.04 Q.L2.2
  Bottom 1.016: SV5.4 SV5.3 SV5.2 SV5.1 X.L1.1
  other vias: 63.5,26.52
  pour Top (no thermals): 59.94,25.04 59.94,27.28 60.35,27.69 64.77,27.69 65.28,27.18 65.28,25.91 64.77,25.4 63.5,25.4 62.74,24.64 60.35,24.64
  pour Bottom (no thermals): 59.94,25.04 59.94,27.28 60.35,27.69 64.77,27.69 65.28,27.18 65.28,25.91 64.77,25.4 63.5,25.4 62.74,24.64 60.35,24.64
VCONV  (via drill 0.25)  (1 unrouted)
  Top 0.254: 37.39,22.92 R.M1.1 35.32,23.1 v35.31,23.11 | v35.81,17.78 35.81,17.27 35.85,17.22 35.85,16.55 v35.56,16.26 | SV19.1 TP41.TP
  Top 0.889: C.M6.P$2 42.45,13.84 40.13,13.84 37.72,16.26 v37.08,16.26
  Top 1.016: SV19.1 SV19.2 SV19.3 SV19.4 | SV23.1 30.91,24.82 v34.16,24.82 | SV23.1 29.97,23.88 v34.54,23.88 | SV23.1 30.23,23.11 v34.54,23.11 | SV23.1 30.99,22.35 v34.54,22.35 | SV23.1 SV23.2 SV23.3 SV23.4
  Bottom 0.254: v35.81,17.78 35.31,18.29 v35.31,18.54 v35.31,19.56 v35.31,20.57 v35.31,21.59 | v35.31,21.59 v34.54,21.59 | v34.54,22.35 v35.31,22.35 | v35.31,22.35 v35.31,21.59 | v35.31,22.35 v35.31,23.11 v34.54,23.11 v34.54,23.88 34.14,24.28 34.14,24.79 | 67.77,25.61 68.63,25.61 68.81,25.79 68.81,27.46 | 67.77,25.61 67.59,25.79 67.59,25.93 v67.49,26.04 v67.49,26.54 | v34.16,24.82 34.14,24.79 | 34.14,24.79 34.01,24.66 | v67.49,26.54 v67.49,27.05 67.08,27.46 v66.93,27.46 | v66.9,25.6 v66.91,25.61 67.77,25.61 | v67.49,26.54 U$1.P$3 | U.M1.8 v35.31,22.35 | C.M5.1
  Bottom 1.016: v35.56,16.26 35.56,15.24 35.39,15.07 C.M7.2 | C.M5.1 36.58,13.16 36.58,16 v36.32,16.26 | SV19.3 73.91,24.89 71.12,24.89 | SV19.1 74.93,18.8 71.12,18.8 | SV23.1 30.91,24.82 v34.16,24.82 | SV23.1 29.97,23.88 v34.54,23.88 | SV23.1 30.23,23.11 v34.54,23.11 | SV23.1 30.99,22.35 v34.54,22.35
  pour Bottom: 38.61,17.02 36.58,17.02 36.32,17.27 36.32,21.34 36.58,21.59 38.61,21.59 38.61,23.11 36.58,23.11 34.29,25.4 32,25.4 31.75,25.15 31.75,22.1 34.04,19.81 34.04,16.66 35.2,15.49 38.61,15.49
  pour Top: 31.75,22.76 31.75,24.89 32.26,25.4 34.29,25.4 36.32,23.37 36.32,17.27 36.58,16.76 37.59,16.76 37.59,15.49 35.2,15.49 34.04,16.66 34.04,20.47
  pour Bottom: 73.15,19.56 71.12,19.56 70.87,19.81 70.87,23.88 71.12,24.13 73.15,24.13 73.15,25.65 71.12,25.65 68.83,27.94 66.55,27.94 66.29,27.69 66.29,24.64 68.58,22.35 68.58,19.2 69.75,18.03 73.15,18.03
  pour Top: 66.29,25.3 66.29,27.43 66.8,27.94 68.83,27.94 70.87,25.91 70.87,19.81 71.12,19.3 72.14,19.3 72.14,18.03 69.75,18.03 68.58,19.2 68.58,23.01
VRAW  (via drill 0.25)  (1 unrouted)
  Top 0.254: v12.93,7.7 13.15,7.93 | 13.15,7.93 13.89,8.67 14.26,8.67 14.54,8.95 14.54,9.45 14.71,9.62 16.31,9.62 v16.76,9.17 | 40.89,30.82 v40.89,29.72 | SV4.2 13.46,4.79 14.1,5.42 14.1,7.28 13.92,7.45 13.63,7.45 13.15,7.93
  Top 1.016: SV4.4 SV4.3 SV4.2 SV4.1 | SV22.4 SV22.3 SV22.2 SV22.1
  Bottom 0.127: 41.25,24.79 U.M1.11 | 41.25,20.57 41.25,17.27 U.M1.22
  Bottom 0.254: U$3.VIN 12.72,8.74 12.72,8.01 12.93,7.8 v12.93,7.7 | C.M2.2 40.3,28.77 40.89,28.77 v40.89,29.72 | C.F9.1 16.78,9.18 v16.76,9.17 | U.M1.11 41.25,20.57 | U.M1.22 41.25,16.51 | U.M1.11 41.25,22.15 v41.3,22.2 | U.M1.11 41.3,21.41 v41.3,20.42 | U.M1.22 41.25,18.34 v41.3,18.39 | U.M1.22 41.3,17.11 v41.3,16.36
  Bottom 0.508: C.M2.2 40.23,25.81
  Bottom 1.016: 45.29,13.03 45.54,12.78 47.65,14.88 C.M1.2 48.49,15.19 50.19,16.89 50.19,16.92 SV22.1 | 45.29,13.03 44.6,13.72 42.67,13.72 41.25,15.14 41.25,16.51 41.25,17.27 | C.M3.+ 45.21,9.65 | 45.21,9.65 45.21,12.95 45.29,13.03 | C.M4.+ 43.68,9.65 45.21,9.65
  pour Bottom (no thermals): 40.56,23.27 arc70 39.83,24.51 arc-102 39.34,26.37 arc-119 41.55,26.14 arc-24 41.96,24.31 arc-1 41.96,23.09 arc-181 40.56,23.11
  pour Top (no thermals): 40.56,23.16 arc70 39.83,24.5 arc-102 39.35,26.35 arc-119 41.56,26.13 arc-24 41.96,24.3 41.96,23.14 41.96,15.34 40.54,15.34 40.56,23.15
  pour Bottom: 40.61,15.49 40.61,14.52 42.34,13.21 43.94,13.21 44.7,12.45 44.7,9.4 45.21,8.89 45.72,8.89 45.72,13.36 44.65,14.48 42.67,14.48 41.91,15.24 41.91,15.49